# Altium schematic sheet LedDriver.SchDoc
size A
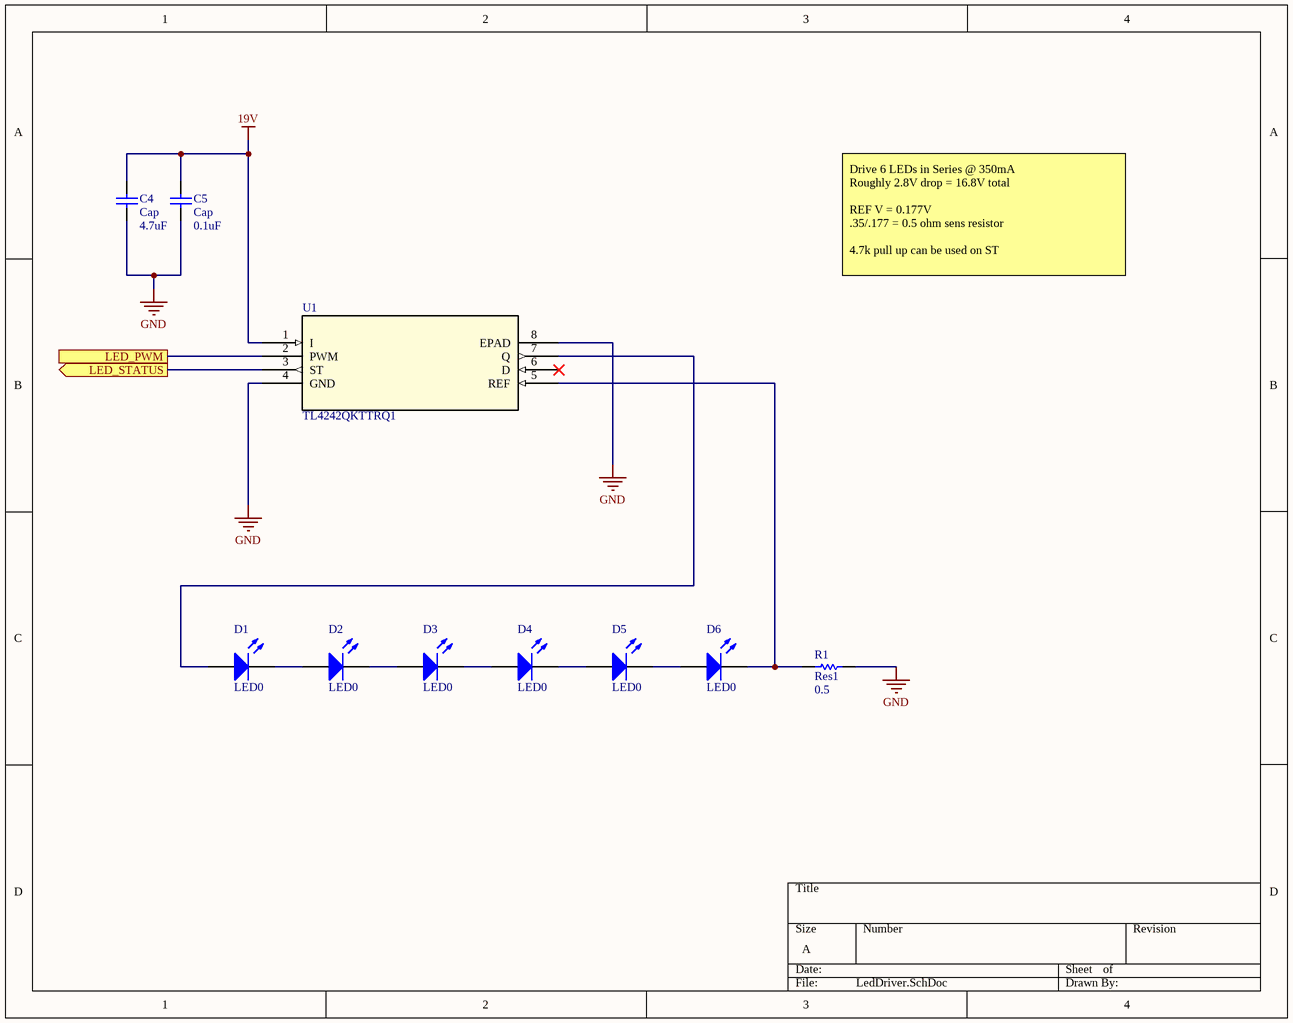
[diagram p0: LedDriver.SchDoc]

## Parts
C4  Cap  value 4.7uF  [RAD-0.3]
C5  Cap  value 0.1uF  [RAD-0.3]
D1  LED0  [LED-0]
D2  LED0  [LED-0]
D3  LED0  [LED-0]
D4  LED0  [LED-0]
D5  LED0  [LED-0]
D6  LED0  [LED-0]
R1  Res1  value 0.5  [AXIAL-0.3]
U1  TL4242QKTTRQ1  [KTT7]

## Ports
LED_PWM, LED_STATUS (out)

## Nets
19V: C4.2 C5.2 U1.1(I)
GND: C4.1 C5.1 R1.2 U1.4(GND) U1.8(EPAD)
LED_PWM: U1.2(PWM) ; port LED_PWM
LED_STATUS: U1.3(ST) ; port LED_STATUS
NetD1_1: D1.1(A) U1.7(Q)
NetD1_2: D1.2(K) D2.1(A)
NetD2_2: D2.2(K) D3.1(A)
NetD3_2: D3.2(K) D4.1(A)
NetD4_2: D4.2(K) D5.1(A)
NetD5_2: D5.2(K) D6.1(A)
NetD6_2: D6.2(K) R1.1 U1.5(REF)

Not connected (* = marked no-connect by the designer): U1 6(D)*

## Notes on the sheet
- Drive 6 LEDs in Series @ 350mA
  Roughly 2.8V drop = 16.8V total
  REF V = 0.177V
  .35/.177 = 0.5 ohm sens resistor
  4.7k pull up can be used on ST

## Library data of the parts
C4 C5 = Cap: Capacitor; Published: 8-Jun-2000; LatestRevisionDate: 17-Jul-2002; LatestRevisionNote: Re-released for DXP Platform.; PackageReference: RAD-0.3; Publisher: Altium Limited; PackageDescription: Radial Cap, Thru-Hole; 2 Leads; 0.3 in Pin Spacing
D1-D6 = LED0: Typical INFRARED GaAs LED; Published: 8-Jun-2000; LatestRevisionDate: 08-Jul-2005; LatestRevisionNote: Mech Layer 1 removed.; PackageReference: LED-0; Publisher: Altium Limited; PackageDescription: LED; 2 Leads
R1 = Res1: Resistor; Published: 8-Jun-2000; LatestRevisionDate: 17-Jul-2002; LatestRevisionNote: Re-released for DXP Platform.; PackageReference: AXIAL-0.3; Publisher: Altium Limited; PackageDescription: Axial Device, Thru-Hole; 2 Leads; 0.3 in Pin Spacing
U1 = TL4242QKTTRQ1: Automotive Catalog Adjustable LED Driver; GENERIC_PART_NUMBER: TL4242-Q1; Vendor: Texas Instruments; PACKAGE_DESIGNATOR: KTT; PIN_COUNT: 7; INDUSTRY_STD_PKG_TYPE: DDPAK/TO-263; Manufacturer_Part_Number: TL4242QKTTRQ1; FAMILY_NAME: LED DRIVER; Datasheet_URL: http://www.ti.com/lit/gpn/TL4242-Q1; Manufacturer: Texas Instruments; Copyright: Copyright (C) 2018 Accelerated Designs. All rights reserved; RefDes: RefDes; Type: DEV